# EAGLE design v1 (EAGLE 6.4)
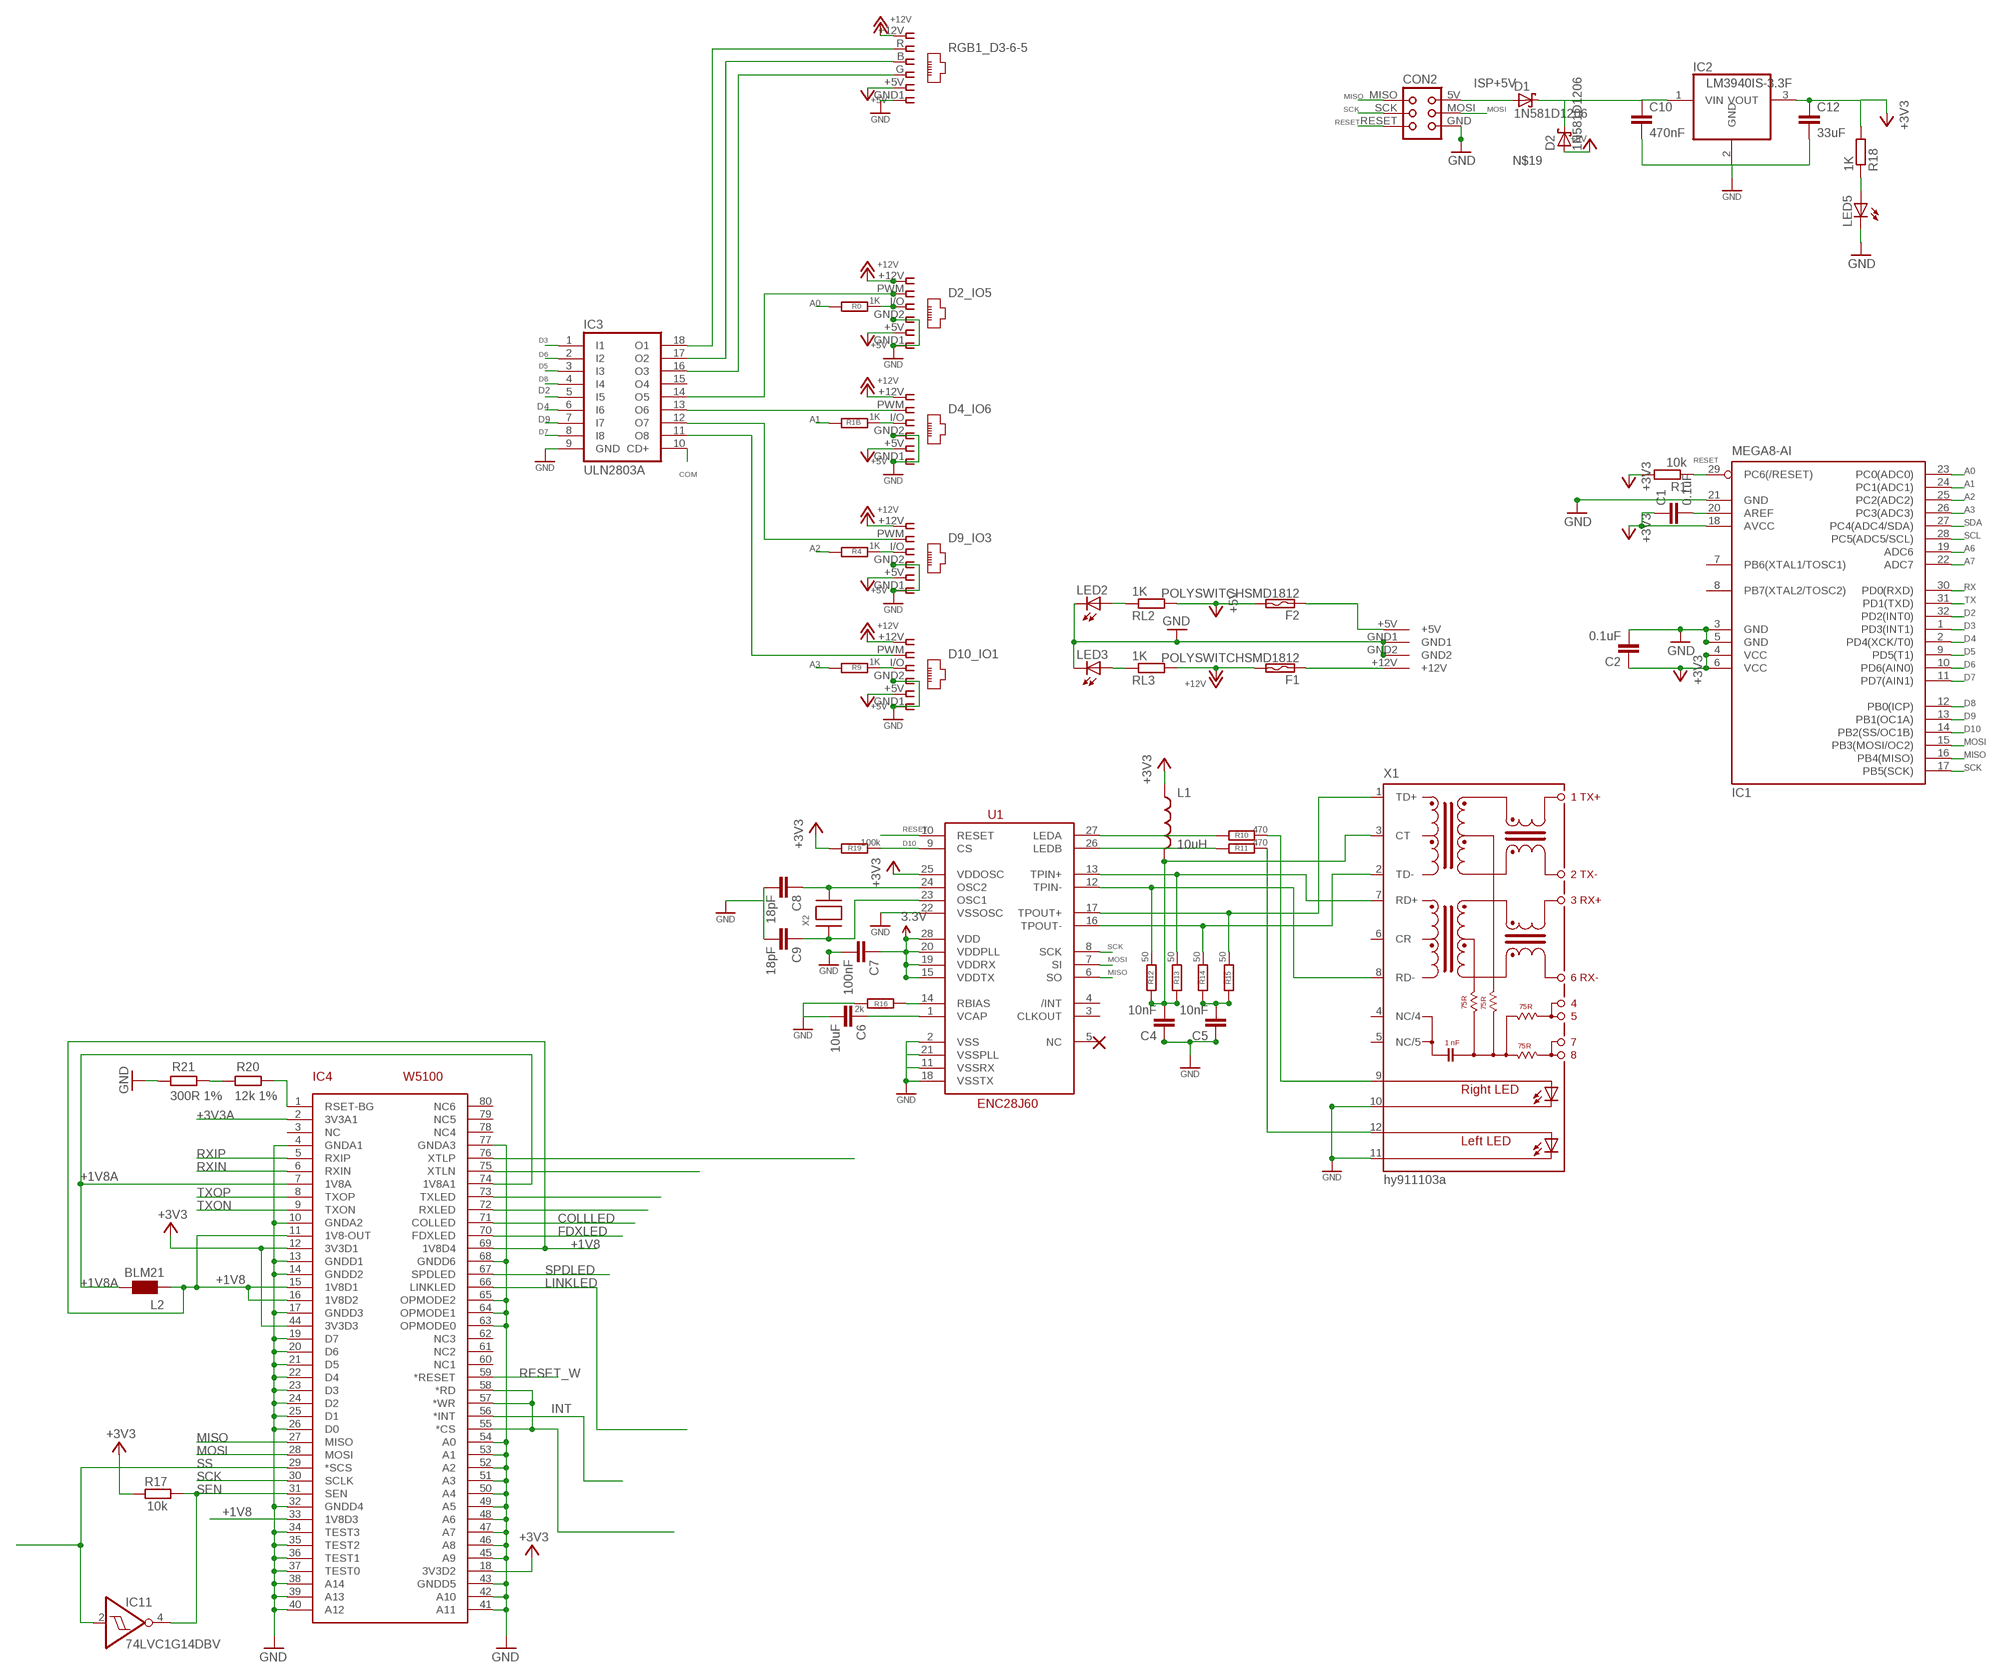
[diagram p0: schematic, sheet 1, part 1 of 2]
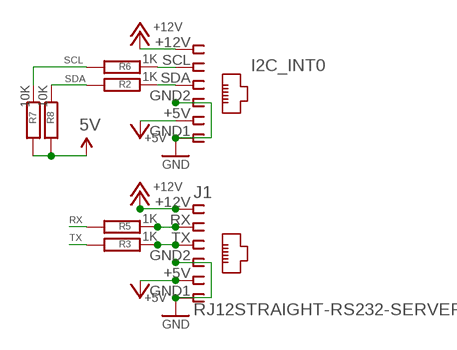
[diagram p1: schematic, sheet 1, part 2 of 2]

## Parts
C1  0.1uF  C-EUC1206  [C1206]
C2  0.1uF  C-EUC1206  [C1206]
C4  10nF  C-EUC1206  [C1206]
C5  10nF  C-EUC1206  [C1206]
C6  10uF  C-EUC1206  [C1206]
C7  100nF  C-EUC1206  [C1206]
C8  18pF  C-EUC1206  [C1206]
C9  18pF  C-EUC1206  [C1206]
C10  470nF  C-EUC1206  [C1206]
C12  33uF  CAP1210  [1210]
CON2  TINYISPTAG  [TC2030-MCP]
D1  1N581D1206  [LED-1206]
D2  1N581D1206  [LED-1206]
D2_IO5  IO5  RJ12STRAIGHT  [RJ12-STRAIGHT]
D4_IO6  IO6  RJ12STRAIGHT  [RJ12-STRAIGHT]
D9_IO3  IO3  RJ12STRAIGHT  [RJ12-STRAIGHT]
D10_IO1  IO1  RJ12STRAIGHT  [RJ12-STRAIGHT]
F1  POLYSWITCHSMD1812  [C1812]
F2  POLYSWITCHSMD1812  [C1812]
I2C_INT0  I2C  RJ12STRAIGHT-I2C  [RJ12-STRAIGHT-I2C]
IC1  MEGA8-AI  [TQFP32-08]
IC2  LM3940IS-3.3F  [DD-3]
IC3  ULN2803A  [SO18W]
IC4  W5100  [SQFP-S-10X10-80]
IC11  74LVC1G14DBV  [SOT23-5]
J1  RJ12STRAIGHT-RS232-SERVER  [RJ12-STRAIGHT-RS232]
L1  10uH  INDUCTOR1206H*  [INDUCTOR-1206]
L2  BLM21  WE-CBF_0805  [0805]
LED2  LED3MM  [LED3MM]
LED3  LED3MM  [LED3MM]
LED5  LED3MM  [LED3MM]
R0  1K  R-EU_M1206  [M1206]
R1  10k  R-EU_M1206  [M1206]
R1B  1K  R-EU_M1206  [M1206]
R2  1K  R-EU_M1206  [M1206]
R3  1K  R-EU_M1206  [M1206]
R4  1K  R-EU_M1206  [M1206]
R5  1K  R-EU_M1206  [M1206]
R6  1K  R-EU_M1206  [M1206]
R7  10K  R-EU_M1206  [M1206]
R8  10K  R-EU_M1206  [M1206]
R9  1K  R-EU_M1206  [M1206]
R10  470  R-EU_M1206  [M1206]
R11  470  R-EU_M1206  [M1206]
R12  50  R-EU_M1206  [M1206]
R13  50  R-EU_M1206  [M1206]
R14  50  R-EU_M1206  [M1206]
R15  50  R-EU_M1206  [M1206]
R16  2k  R-EU_M1206  [M1206]
R17  10k  R-EU_0603-RND  [R0603-ROUND]
R18  1K  R-EU_M1206  [M1206]
R19  100k  R-EU_M1206  [M1206]
R20  12k 1%  R-EU_0603-RND  [R0603-ROUND]
R21  300R 1%  R-EU_0603-RND  [R0603-ROUND]
RGB1_D3-6-5  RGB1  RJ12STRAIGHT-RGB  [RJ12-STRAIGHT-RGB]
RL2  1K  R-EU_M1206  [M1206]
RL3  1K  R-EU_M1206  [M1206]
U1  ENC28J60SO  [SO28W]
U$2  KPJX-4S-S  [KPJX-4S-S]
X1  hy911103a  J1011F01P  [J1]
X2  XTALNX5032  [NX5032]

## Nets
3.3V: C7.1 U1.15(VDDTX) U1.19(VDDRX) U1.20(VDDPLL) U1.28(VDD)
5V [power]: R7.2 R8.2
+1V8 [power]: IC4.11(1V8-OUT) IC4.15(1V8D1) IC4.16(1V8D2) IC4.33(1V8D3) IC4.69(1V8D4) L2.1
+1V8A [power]: IC4.7(1V8A) IC4.74(1V8A1) L2.2
+3V3 [power]: C1.1 C2.1 C12.1 IC1.4(VCC) IC1.6(VCC) IC1.18(AVCC) IC2.3(VOUT) IC4.12(3V3D1) IC4.18(3V3D2) IC4.44(3V3D3) L1.P$1 R1.2 R17.1 R18.2 R19.2 U1.25(VDDOSC)
+3V3A [power]: IC4.2(3V3A1)
+5V: D2.A D2_IO5.+5V D4_IO6.+5V D9_IO3.+5V D10_IO1.+5V F2.2 I2C_INT0.+5V J1.+5V RGB1_D3-6-5.+5V RL2.2
+12V [highpower]: D2_IO5.+12V D4_IO6.+12V D9_IO3.+12V D10_IO1.+12V F1.2 I2C_INT0.+12V J1.+12V RGB1_D3-6-5.+12V RL3.2
A0: IC1.23(PC0(ADC0)) R0.2
A1 [fine]: IC1.24(PC1(ADC1)) R1B.2
A2 [fine]: IC1.25(PC2(ADC2)) R4.2
A3 [fine]: IC1.26(PC3(ADC3)) R9.2
A6: IC1.19(ADC6)
A7: IC1.22(ADC7)
COLLLED: IC4.71(COLLED)
COM: IC3.10(CD+)
D2: IC1.32(PD2(INT0)) IC3.5(I5)
D2B: D9_IO3.I/O R4.1
D2B1: D10_IO1.I/O R9.1
D2B4: I2C_INT0.SDA R2.1
D2B5: J1.TX R3.1
D2B6: D2_IO5.I/O R0.1
D2B7: D4_IO6.I/O R1B.1
D3: IC1.1(PD3(INT1)) IC3.1(I1)
D4: IC1.2(PD4(XCK/T0)) IC3.6(I6)
D5: IC1.9(PD5(T1)) IC3.3(I3)
D6: IC1.10(PD6(AIN0)) IC3.2(I2)
D7: IC1.11(PD7(AIN1)) IC3.8(I8)
D8: IC1.12(PB0(ICP)) IC3.4(I4)
D9: IC1.13(PB1(OC1A)) IC3.7(I7)
D10: IC1.14(PB2(SS/OC1B)) R19.1 U1.9(CS)
FDXLED: IC4.70(FDXLED)
GND [power]: C2.2 C4.1 C5.1 C6.2 C7.2 C8.2 C9.2 C10.2 C12.2 CON2.GND D2_IO5.GND1 D2_IO5.GND2 D4_IO6.GND1 D4_IO6.GND2 D9_IO3.GND1 D9_IO3.GND2 D10_IO1.GND1 D10_IO1.GND2 I2C_INT0.GND1 I2C_INT0.GND2 IC1.3(GND) IC1.5(GND) IC1.21(GND) IC2.2(GND) IC3.9(GND) IC4.4(GNDA1) IC4.10(GNDA2) IC4.13(GNDD1) IC4.14(GNDD2) IC4.17(GNDD3) IC4.19(D7) IC4.20(D6) IC4.21(D5) IC4.22(D4) IC4.23(D3) IC4.24(D2) IC4.25(D1) IC4.26(D0) IC4.32(GNDD4) IC4.34(TEST3) IC4.35(TEST2) IC4.36(TEST1) IC4.37(TEST0) IC4.38(A14) IC4.39(A13) IC4.40(A12) IC4.41(A11) IC4.42(A10) IC4.43(GNDD5) IC4.45(A9) IC4.46(A8) IC4.47(A7) IC4.48(A6) IC4.49(A5) IC4.50(A4) IC4.51(A3) IC4.52(A2) IC4.53(A1) IC4.54(A0) IC4.63(OPMODE0) IC4.64(OPMODE1) IC4.65(OPMODE2) IC4.68(GNDD6) IC4.77(GNDA3) J1.GND1 J1.GND2 LED2.K(C) LED3.K(C) LED5.K(C) R16.1 R21.2 RGB1_D3-6-5.GND1 U1.2(VSS) U1.11(VSSRX) U1.18(VSSTX) U1.21(VSSPLL) U1.22(VSSOSC) U$2.GND1 U$2.GND2 X1.10(C-R) X1.11(C-L)
INT: IC4.56(*INT)
ISP+5V: CON2.5V(VCC) D1.A
LINKLED: IC4.66(LINKLED)
MISO [fine]: CON2.MISO IC1.16(PB4(MISO)) IC4.27(MISO) U1.6(SO)
MOSI [fine]: CON2.MOSI IC1.15(PB3(MOSI/OC2)) IC4.28(MOSI) U1.7(SI)
N$1 [power]: IC3.16(O3) RGB1_D3-6-5.G
N$2: D4_IO6.PWM IC3.13(O6)
N$3: IC4.73(TXLED)
N$4: C1.2 IC1.20(AREF)
N$5: LED5.A R18.1
N$6: F2.1 U$2.+5V
N$7: IC4.72(RXLED)
N$8: F1.1 U$2.+12V
N$9 [fine]: R10.2 U1.27(LEDA)
N$10 [fine]: R11.2 U1.26(LEDB)
N$11: R10.1 X1.9(A-R)
N$12: R11.1 X1.12(AL)
N$13 [fine]: R15.1 U1.17(TPOUT+) X1.1(TD+)
N$14 [fine]: R14.1 U1.16(TPOUT-) X1.2(TD-)
N$15 [fine]: R13.1 U1.13(TPIN+) X1.7(RD+)
N$16 [fine]: R12.1 U1.12(TPIN-) X1.8(RD-)
N$17 [fine]: C4.2 L1.P$2 R12.2 R13.2 X1.3(CT)
N$18 [fine]: C5.2 R14.2 R15.2
N$19 [power]: C10.1 D1.C D2.C IC2.1(VIN)
N$22 [power]: D9_IO3.PWM IC3.12(O7)
N$26 [fine]: C6.1 U1.1(VCAP)
N$27 [fine]: R16.2 U1.14(RBIAS)
N$28 [fine]: C9.1 U1.23(OSC1) X2.P$1
N$29 [fine]: C8.1 U1.24(OSC2) X2.P$2
N$30: R20.2 R21.1
N$31: IC4.1(RSET-BG) R20.1
N$36: IC4.55(*CS) IC4.57(*WR) IC4.58(*RD)
N$50 [power]: IC3.17(O2) RGB1_D3-6-5.B
N$51 [power]: D10_IO1.PWM IC3.11(O8)
N$60 [power]: D2_IO5.PWM IC3.14(O5)
N$68 [power]: IC3.18(O1) RGB1_D3-6-5.R
N$70: J1.RX R5.1
N$71: I2C_INT0.SCL R6.1
N$75: LED3.A RL3.1
N$76: LED2.A RL2.1
OSC1E: IC4.76(XTLP)
OSC2E: IC4.75(XTLN)
RESET [fine]: CON2.RESET IC1.29(PC6(/RESET)) R1.1 U1.10(RESET)
RESET_W: IC4.59(*RESET)
RX: IC1.30(PD0(RXD)) R5.2
RXIN: IC4.6(RXIN)
RXIP: IC4.5(RXIP)
SCK [fine]: CON2.SCK IC1.17(PB5(SCK)) IC4.30(SCLK) U1.8(SCK)
SCL: IC1.28(PC5(ADC5/SCL)) R6.2 R7.1
SDA: IC1.27(PC4(ADC4/SDA)) R2.2 R8.1
SEN: IC4.31(SEN) IC11.4(O) R17.2
SPDLED: IC4.67(SPDLED)
SS: IC4.29(*SCS) IC11.2(I)
TX: IC1.31(PD1(TXD)) R3.2
TXON: IC4.9(TXON)
TXOP: IC4.8(TXOP)
Unconnected: IC1.7(PB6(XTAL1/TOSC1)) IC1.8(PB7(XTAL2/TOSC2)) IC3.15(O4) IC4.3(NC) IC4.60(NC1) IC4.61(NC2) IC4.62(NC3) IC4.78(NC4) IC4.79(NC5) IC4.80(NC6) U1.3(CLKOUT) U1.4(/INT) U1.5(NC) X1.4(NC/4) X1.5(NC/5) X1.6(CR)

## Power pins joined to a net without a drawn wire
GND: IC11.3(GND)
VCC: IC11.5(VCC)

## Library data of the parts
C1 C2 C4-C9 = resistor:C-EU: CAPACITOR, European symbol
C10 = rcl:C-EU: CAPACITOR, European symbol
C12 = SparkFun:CAP: Capacitor Standard 0603 ceramic capacitor, and 0.1" leaded capacitor.
CON2 = lpatiny:TINYISP: CONNECTOR
D1 D2 = lpatiny:1N581*: 1.0A SCHOTTKY BARRIER RECTIFIER Source: http://www.diodes.com/datasheets/ds23001.pdf
D2_IO5 D4_IO6 D9_IO3 D10_IO1 I2C_INT0 J1 RGB1_D3-6-5 = lpatiny:RJ12: CORCOM Modular RJ Jacks No Shield Source: www.tycoelectronics.com .. ENG_DS_1654001_1099_RJ_L_0507.pdf
F1 F2 = lpatiny:POLYSWITCH: PolySwitch (TM) Resettable Device Source: Data sheet <http://www.farnell.com/datasheets/13482.pdf>
IC1 = atmel:MEGA8: MICROCONTROLLER 8 Kbytes FLASH, 1 kbytes SRAM, 512 bytes EEPROM, USART, 6-channel 10 bit ADC, 2-channel 8 bit ADC Pin compatible with Atmega48, ATMega88, ATMega168 Source: avr.lbr; MPN: ATMEGA8-16AU; OC_FARNELL: 9171371; OC_NEWARK: 73M8863
IC2 = lpatiny:LM3940IS-3.3: 1A Low Dropout (LDO) for 5V to 3.3V conversion; MF: TEXAS INSTRUMENTS; MPN: REG1117FAKTTT; OC_FARNELL: 1296120; OC_NEWARK: 87H2562
IC3 = lpatiny:ULN2803A: DRIVER ARRAY
IC4 = SmartPrj:W5100
IC11 = 74xx-little-de:74*1G14: Single Schmitt-Trigger Inverter Gate
L1 = SparkFun:INDUCTOR: Inductors Basic Inductor/Choke - 0603 and 1206. Footprints are not proven and vary greatly between part numbers.
L2 = wuerth-elektronik:WE-CBF: SMD EMI Suppression Ferrite Beads - excellent anti-EMI properties - low DCR - impedances till 3000 ohms - rated current up to 6 A
LED2 LED3 LED5 = lpatiny:LED3MM
R0 R1 R1B R2-R16 R18 R19 RL2 RL3 = resistor:R-EU_: RESISTOR, European symbol
R17 R20 R21 = SmartPrj:R-EU_: RESISTOR, European symbol
U1 = lpatiny:ENC28J60
U$2 = lpatiny:KPJX-4S-S
X1 = con-pulse:J1011F: PULSEJACK (TM) 1x1 Tab-UP RJ45 10/100 Base-TX RJ45 1x1 Tab-UP with LEDs 8-pin (J1 series) and 6-pin (JP series) integrated magnetics connector, designed to support applications, such as ADSL modems, LAN-on-Motherboard, and Hub and Switches. Source: www.pulseeng.com .. PulseJack-J402.pdf; OC_FARNELL: unknown; OC_NEWARK: unknown
X2 = adafruit:XTAL: Low cost SMT crystals, no capacitors included http://www.ladyada.net/library/eagle

## Net classes
0 default: width 0.457 mm
1 power: width 0.457 mm
2 highpower: width 0.914 mm
3 fine: width 0.203 mm

## Board
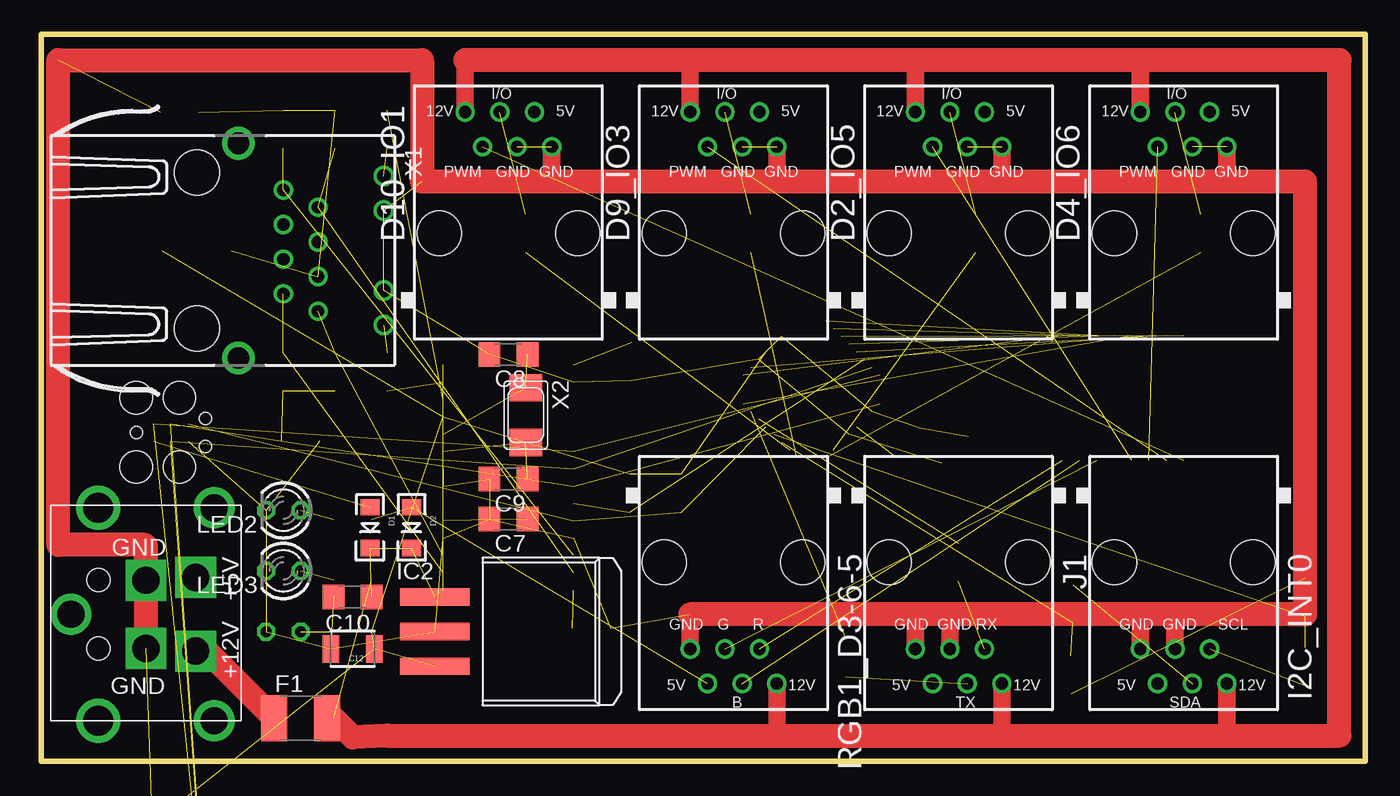
[diagram p2: board, top side]
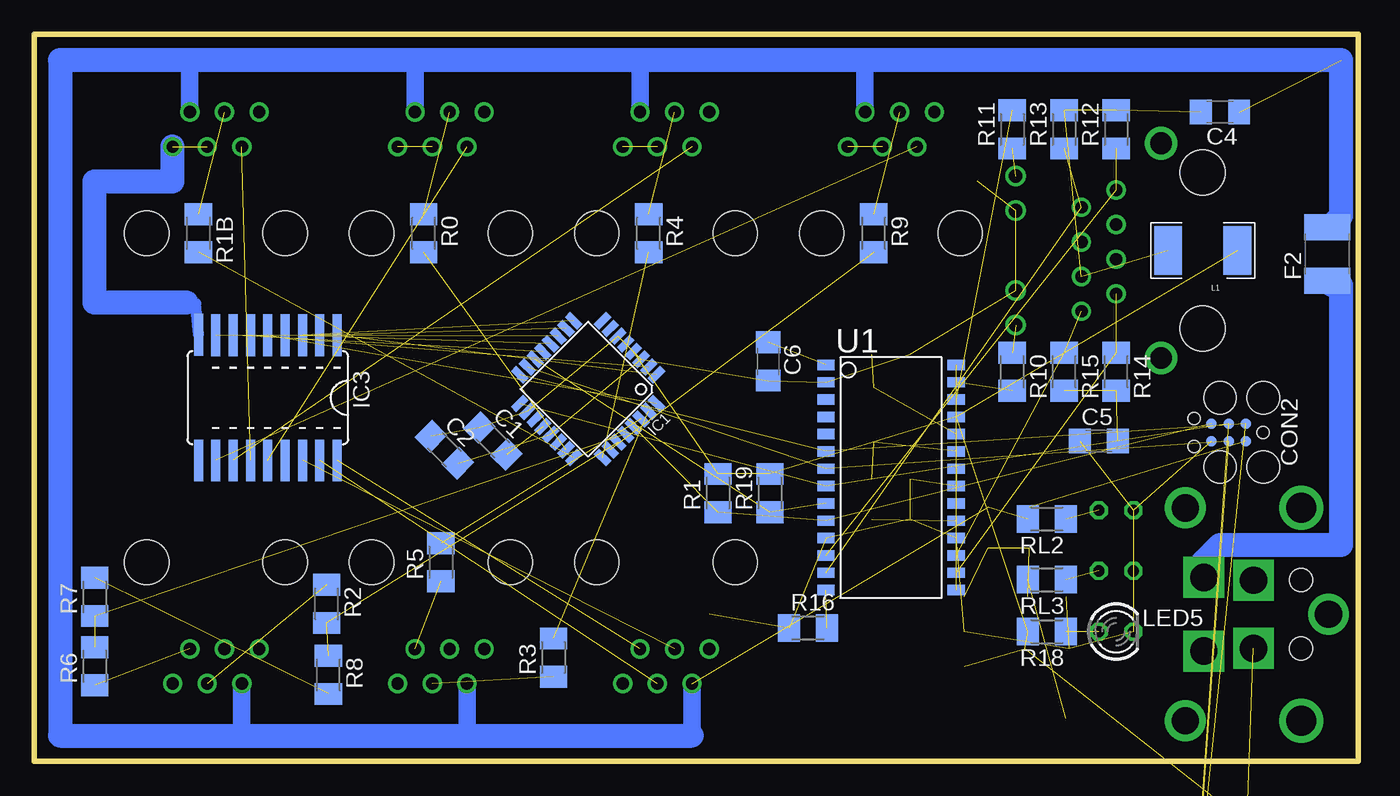
[diagram p3: board, bottom side, seen from below]

Size 97.16 x 53.34 mm. Coordinates in mm from the lower left corner, seen from the top.
Outline: 0,0 0,53.34 97.16,53.34 97.16,0 0,0
Copper layers (1*16): Top 0.035mm / dielectric 1.5mm / Bottom 0.035mm
Design rules "default *": minimum track width 10mil, minimum drill 24mil, track to track 8mil, track to pad 8mil, pad to pad 8mil, via to via 8mil, smd to smd 8mil, copper to edge 6mil, drill to drill 6mil, minimum pad ring 10mil, minimum via ring 8mil, stop-mask expansion 4mil, vias tented up to drill 0mil, thermal gap 10mil
vRestrict: area 47.1,17.5 to 65,35.5; area 73.7,28.6 to 86.4,33.7; area 73.7,19.7 to 86.4,24.8; area 36.8,10.8 to 40.6,31.1; area 27.9,10.8 to 31.8,31.1

### Footprints (pad centres in the part's own frame; a part is rotated, then mirrored left to right if it is on the bottom)
C1206 = smd 1.6 x 1.8: 1 -1.4,0; 2 1.4,0
1210 = smd 1.2 x 2: 1 -1.6,0; 2 1.6,0
TC2030-MCP = smd 0.787 x 0.787: 5V 1.27,0.635; GND 3.81,0.635; MISO 1.27,-0.635; MOSI 2.54,0.635; RESET 3.81,-0.635; SCK 2.54,-0.635 | hole 0.889: 0,0; 5.08,-1.016; 5.08,1.016 | hole 2.375: 0,2.54; 0,-2.54; 3.175,-2.54; 3.175,2.54
LED-1206 = smd 1.2 x 1.4: A -1.5,0; C 1.5,0
RJ12-STRAIGHT = drill 0.9 pad 1.4: +5V 1.905,8.89; +12V -3.175,8.89; GND1 3.175,6.35; GND2 0.635,6.35; I/O -0.635,8.89; PWM -1.905,6.35 | hole 3.251: -5.08,0; 5.08,0
C1812 = smd 1.9 x 3.4: 1 -1.95,0; 2 1.95,0
RJ12-STRAIGHT-I2C = drill 0.9 pad 1.4: +5V 1.905,8.89; +12V -3.175,8.89; GND1 3.175,6.35; GND2 0.635,6.35; SCL -1.905,6.35; SDA -0.635,8.89 | hole 3.251: -5.08,0; 5.08,0
TQFP32-08 = smd 1.27 x 0.559: 1 -4.293,2.8; 2 -4.293,2; 3 -4.293,1.2; 4 -4.293,0.4; 5 -4.293,-0.4; 6 -4.293,-1.2; 7 -4.293,-2; 8 -4.293,-2.8; 17 4.293,-2.8; 18 4.293,-2; 19 4.293,-1.2; 20 4.293,-0.4; 21 4.293,0.4; 22 4.293,1.2; 23 4.293,2; 24 4.293,2.8 | smd 0.559 x 1.27: 9 -2.8,-4.293; 10 -2,-4.293; 11 -1.2,-4.293; 12 -0.4,-4.293; 13 0.4,-4.293; 14 1.2,-4.293; 15 2,-4.293; 16 2.8,-4.293; 25 2.8,4.293; 26 2,4.293; 27 1.2,4.293; 28 0.4,4.293; 29 -0.4,4.293; 30 -1.2,4.293; 31 -2,4.293; 32 -2.8,4.293
DD-3 = smd 1.27 x 5.08: 1 -2.54,-7.938; 2 0,-7.938; 3 2.54,-7.938
SO18W = smd 0.66 x 3.048: 1 -5.08,-4.585; 2 -3.81,-4.585; 3 -2.54,-4.585; 4 -1.27,-4.585; 5 0,-4.585; 6 1.27,-4.585; 7 2.54,-4.585; 8 3.81,-4.585; 9 5.08,-4.623; 10 5.08,4.585; 11 3.81,4.585; 12 2.54,4.585; 13 1.27,4.585; 14 0,4.585; 15 -1.27,4.585; 16 -2.54,4.585; 17 -3.81,4.585; 18 -5.08,4.585
SQFP-S-10X10-80 = smd 0.25 x 1.6: 1 -3.8,-5.6; 2 -3.4,-5.6; 3 -3,-5.6; 4 -2.6,-5.6; 5 -2.2,-5.6; 6 -1.8,-5.6; 7 -1.4,-5.6; 8 -1,-5.6; 9 -0.6,-5.6; 10 -0.2,-5.6; 11 0.2,-5.6; 12 0.6,-5.6; 13 1,-5.6; 14 1.4,-5.6; 15 1.8,-5.6; 16 2.2,-5.6; 17 2.6,-5.6; 18 3,-5.6; 19 3.4,-5.6; 20 3.8,-5.6; 41 3.8,5.6; 42 3.4,5.6; 43 3,5.6; 44 2.6,5.6; 45 2.2,5.6; 46 1.8,5.6; 47 1.4,5.6; 48 1,5.6; 49 0.6,5.6; 50 0.2,5.6; 51 -0.2,5.6; 52 -0.6,5.6; 53 -1,5.6; 54 -1.4,5.6; 55 -1.8,5.6; 56 -2.2,5.6; 57 -2.6,5.6; 58 -3,5.6; 59 -3.4,5.6; 60 -3.8,5.6 | smd 1.6 x 0.25: 21 5.6,-3.8; 22 5.6,-3.4; 23 5.6,-3; 24 5.6,-2.6; 25 5.6,-2.2; 26 5.6,-1.8; 27 5.6,-1.4; 28 5.6,-1; 29 5.6,-0.6; 30 5.6,-0.2; 31 5.6,0.2; 32 5.6,0.6; 33 5.6,1; 34 5.6,1.4; 35 5.6,1.8; 36 5.6,2.2; 37 5.6,2.6; 38 5.6,3; 39 5.6,3.4; 40 5.6,3.8; 61 -5.6,3.8; 62 -5.6,3.4; 63 -5.6,3; 64 -5.6,2.6; 65 -5.6,2.2; 66 -5.6,1.8; 67 -5.6,1.4; 68 -5.6,1; 69 -5.6,0.6; 70 -5.6,0.2; 71 -5.6,-0.2; 72 -5.6,-0.6; 73 -5.6,-1; 74 -5.6,-1.4; 75 -5.6,-1.8; 76 -5.6,-2.2; 77 -5.6,-2.6; 78 -5.6,-3; 79 -5.6,-3.4; 80 -5.6,-3.8
SOT23-5 = smd 0.69 x 0.99: 1 -0.95,-1.29; 2 0,-1.29; 3 0.95,-1.29; 4 0.95,1.3; 5 -0.95,1.3
RJ12-STRAIGHT-RS232 = drill 0.9 pad 1.4: +5V 1.905,8.89; +12V -3.175,8.89; GND1 3.175,6.35; GND2 0.635,6.35; RX -1.905,6.35; TX -0.635,8.89 | hole 3.251: -5.08,0; 5.08,0
INDUCTOR-1206 = smd 2.032 x 3.556: P$1 -2.54,0; P$2 2.54,0
0805 = smd 1.2 x 1: 1 -1.1,0; 2 1.1,0
LED3MM = drill 0.813 octagon: A -1.27,0; K 1.27,0
M1206 = smd 1.6 x 2: 1 -1.4,0; 2 1.4,0
R0603-ROUND = smd 0.898 x 1.1: 1 -0.889,0; 2 0.889,0
RJ12-STRAIGHT-RGB = drill 0.9 pad 1.4: +5V 1.905,8.89; +12V -3.175,8.89; B -0.635,8.89; G 0.635,6.35; GND1 3.175,6.35; R -1.905,6.35 | hole 3.251: -5.08,0; 5.08,0
SO28W = smd 0.762 x 1.27: 1 -7.62,-4.78; 2 -6.35,-4.78; 3 -5.08,-4.78; 4 -3.81,-4.78; 5 -2.54,-4.78; 6 -1.27,-4.78; 7 0,-4.78; 8 1.27,-4.78; 9 2.54,-4.78; 10 3.81,-4.78; 11 5.08,-4.78; 12 6.35,-4.78; 13 7.62,-4.78; 14 8.89,-4.78; 15 8.89,4.78; 16 7.62,4.78; 17 6.35,4.78; 18 5.08,4.78; 19 3.81,4.78; 20 2.54,4.78; 21 1.27,4.78; 22 0,4.78; 23 -1.27,4.78; 24 -2.54,4.78; 25 -3.81,4.78; 26 -5.08,4.78; 27 -6.35,4.78; 28 -7.62,4.78
KPJX-4S-S = drill 2 square: +5V 2.7,1.35; +12V -2.7,1.35; GND1 -2.5,5; GND2 2.5,5 | drill 2: P$1 -7.8,0; P$2 7.8,0; P$11 0,10.5 | drill 2.2: P$3 -7.8,8.5; P$4 7.8,8.5 | hole 1.7: -2.5,8.5; 2.5,8.5
J1 = drill 0.9 pad 1.3: 1 4.445,2.54; 2 3.175,0; 3 1.905,2.54; 4 0.635,0; 5 -0.635,2.54; 6 -1.905,0; 7 -3.175,2.54; 8 -4.445,0 | drill 1 pad 1.422: 9 5.465,7.37; 10 2.925,7.37; 11 -2.925,7.37; 12 -5.465,7.37 | drill 1.6 pad 2.184: M1 -7.875,-3.3; M2 7.875,-3.3 | hole 3.3: 5.715,-6.35; -5.715,-6.35
NX5032 = smd 2 x 2.4: P$1 2,0; P$2 -2,0

### Placement (x,y rotation side)
C1  63.5,23.5 315 bottom
C2  67.06,22.86 315 bottom
C4  10.16,47.62 180 bottom
C5  19.05,23.5 0 bottom
C6  43.31,29.34 270 bottom
C7  34.29,17.78 180 top
C8  34.29,29.85 180 top
C9  34.29,20.7 180 top
C10  22.86,12.06 180 top
C12  22.86,8.26 180 top
CON2  6.99,24.13 180 bottom
D1  24.13,17.15 270 top
D2  27.18,17.15 270 top
D2_IO5  67.31,38.73 0 top
D4_IO6  83.82,38.73 0 top
D9_IO3  50.8,38.73 0 top
D10_IO1  34.29,38.73 0 top
F1  19.05,3.17 0 top
F2  2.29,37.21 90 bottom
I2C_INT0  83.82,14.61 180 top
IC1  56.52,27.31 225 bottom
IC2  36.83,9.53 270 top
IC3  80.01,26.67 180 bottom
IC4  6.35,-9.53 0 top  (outside the outline)
IC11  2.54,-20.95 0 top  (outside the outline)
J1  67.31,14.61 180 top
L1  11.43,37.46 180 bottom
L2  1.27,-33.66 0 top  (outside the outline)
LED2  17.78,18.42 180 top
LED3  17.78,13.97 180 top
LED5  17.78,9.53 0 bottom
R0  68.58,38.73 270 bottom
R1  46.99,19.69 90 bottom
R1B  85.09,38.73 270 bottom
R2  75.69,11.56 270 bottom
R3  59.05,7.62 90 bottom
R4  52.07,38.73 270 bottom
R5  67.31,14.61 90 bottom
R6  92.71,6.98 90 bottom
R7  92.71,12.06 90 bottom
R8  75.56,6.35 270 bottom
R9  35.56,38.73 270 bottom
R10  25.4,28.58 270 bottom
R11  25.4,46.35 90 bottom
R12  17.78,46.35 90 bottom
R13  21.59,46.35 90 bottom
R14  17.78,28.58 270 bottom
R15  21.59,28.58 270 bottom
R16  40.39,9.78 0 bottom
R17  17.78,-28.57 0 top  (outside the outline)
R18  22.86,9.53 180 bottom
R19  43.18,19.69 90 bottom
R20  10.16,-28.57 0 top  (outside the outline)
R21  1.27,-28.57 0 top  (outside the outline)
RGB1_D3-6-5  50.8,14.61 180 top
RL2  22.86,17.78 180 bottom
RL3  22.86,13.33 180 bottom
U1  34.29,21.46 270 bottom
U$2  12.7,10.79 90 top
X1  17.78,37.46 270 top
X2  35.56,25.4 270 top

### Tracks (layer width: path | path; a pad name or v marks a point on that pad's centre or on a via)
3.3V  (4 unrouted)
5V  (1 unrouted)
+1V8  (5 unrouted)
+1V8A  (2 unrouted)
+3V3  (15 unrouted)
+5V  (2 unrouted)
  Bottom 1.27: 48.9,1.91 RGB1_D3-6-5.+5V | J1.+5V 65.41,1.91 | I2C_INT0.+5V 81.92,1.91 | D4_IO6.+5V 85.72,51.43 | D2_IO5.+5V 69.22,51.43 | D9_IO3.+5V 52.7,51.43 | D10_IO1.+5V 36.2,51.43
  Bottom 1.778: 48.9,1.91 65.41,1.91 81.92,1.91 95.25,1.91 95.25,51.43 85.72,51.43 69.22,51.43 52.7,51.43 36.2,51.43 1.27,51.43 1.27,40 2.11,39.16 F2.2
+12V  (1 unrouted)
  Top 1.27: 31.11,51.43 D10_IO1.+12V | D9_IO3.+12V 47.62,51.43 | RGB1_D3-6-5.+12V 53.98,1.91 | J1.+12V 70.48,1.91 | I2C_INT0.+12V 87,1.91 | D4_IO6.+12V 80.64,51.43 | D2_IO5.+12V 64.14,51.43
  Top 1.778: 31.11,51.43 47.62,51.43 64.14,51.43 80.64,51.43 95.25,51.43 95.25,1.91 87,1.91 70.48,1.91 53.98,1.91 25.4,1.91 22.86,1.77 21.46,3.17 F1.2
A0  (1 unrouted)
A1  (1 unrouted)
A2  (1 unrouted)
A3  (1 unrouted)
D2  (1 unrouted)
D2B  (1 unrouted)
D2B1  (1 unrouted)
D2B4  (1 unrouted)
D2B5  (1 unrouted)
D2B6  (1 unrouted)
D2B7  (1 unrouted)
D3  (1 unrouted)
D4  (1 unrouted)
D5  (1 unrouted)
D6  (1 unrouted)
D7  (1 unrouted)
D8  (1 unrouted)
D9  (1 unrouted)
D10  (2 unrouted)
GND  (70 unrouted)
  Top 1.27: 47.62,10.79 RGB1_D3-6-5.GND1 | J1.GND1 64.14,10.79 | I2C_INT0.GND1 80.64,10.79 | J1.GND2 66.67,10.79 | D4_IO6.GND1 87,42.54 | D2_IO5.GND1 70.48,42.54 | D9_IO3.GND1 53.98,42.54 | D10_IO1.GND1 37.47,42.54 | I2C_INT0.GND2 83.19,10.79
  Top 1.778: 47.62,10.79 64.14,10.79 66.67,10.79 80.64,10.79 83.19,10.79 92.71,10.79 92.71,42.54 87,42.54 70.48,42.54 53.98,42.54 37.47,42.54 27.94,42.54 27.94,51.43 1.27,51.43 1.27,15.88 7.62,15.88 7.7,15.79 U$2.GND2 U$2.GND1
  Bottom 0.813: IC3.9 85.29,33.58 85.98,33.66
  Bottom 1.778: 85.98,33.66 92.71,33.66 92.71,42.54 87,42.54 D4_IO6.GND1
ISP+5V  (1 unrouted)
MISO  (3 unrouted)
MOSI  (3 unrouted)
N$1  (1 unrouted)
N$2  (1 unrouted)
N$4  (1 unrouted)
N$5  (1 unrouted)
N$6
  Bottom 1.778: U$2.+5V 11.35,14.69 10.16,15.88 1.27,15.88 1.27,34.92 1.95,34.92 F2.1
N$8
  Top 1.778: U$2.+12V 12.18,8.1 F1.1
N$9  (1 unrouted)
N$10  (1 unrouted)
N$11  (1 unrouted)
N$12  (1 unrouted)
N$13  (2 unrouted)
N$14  (2 unrouted)
N$15  (2 unrouted)
N$16  (2 unrouted)
N$17  (4 unrouted)
N$18  (2 unrouted)
N$19  (3 unrouted)
N$22  (1 unrouted)
N$26  (1 unrouted)
N$27  (1 unrouted)
N$28  (2 unrouted)
N$29  (2 unrouted)
N$30  (1 unrouted)
N$31  (1 unrouted)
N$36  (2 unrouted)
N$50  (1 unrouted)
N$51  (1 unrouted)
N$60  (1 unrouted)
N$68  (1 unrouted)
N$70  (1 unrouted)
N$71  (1 unrouted)
N$75  (1 unrouted)
N$76  (1 unrouted)
RESET  (3 unrouted)
RX  (1 unrouted)
SCK  (3 unrouted)
SCL  (2 unrouted)
SDA  (2 unrouted)
SEN  (2 unrouted)
SS  (1 unrouted)
TX  (1 unrouted)